# Altium schematic sheet CW308T_to_cardedge.SchDoc: <Enter Sheet Title>
size Letter; Organization: NewAE Technology Inc.; Address1: 1083 Queen St., Suite 196; Address2: Halifax; Address3: NS; Address4: Canada B3H 0B2; SheetApproved: NO
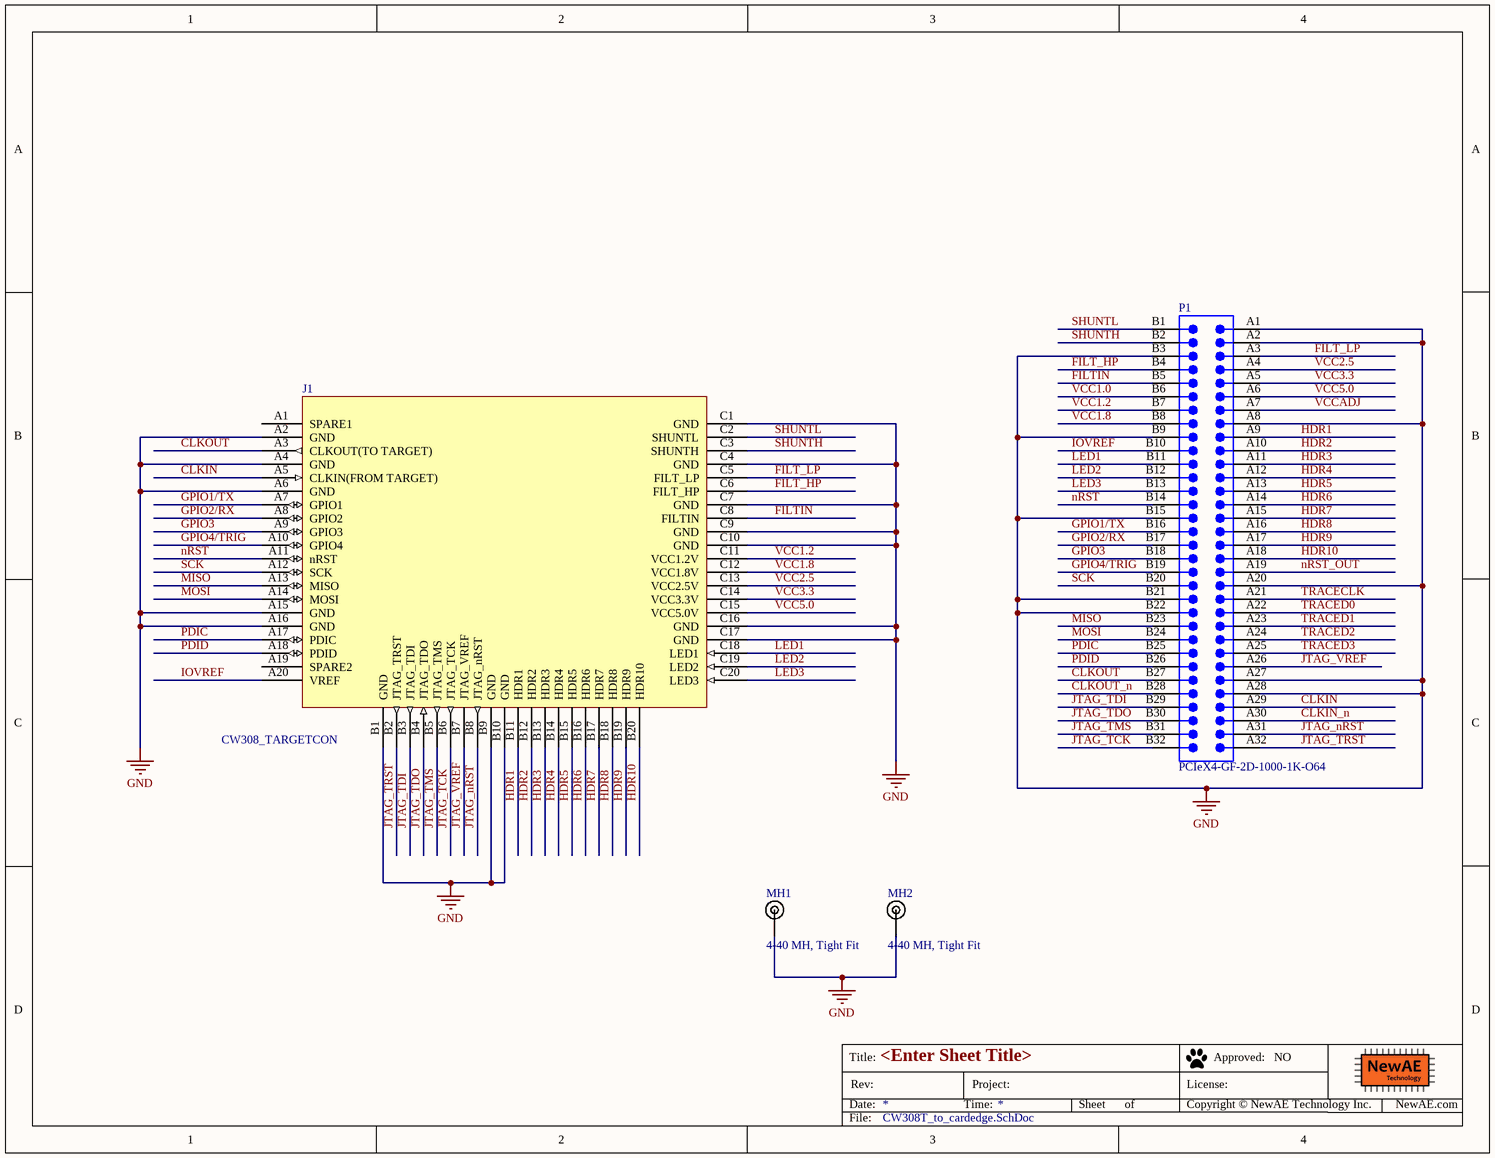
[diagram p0: CW308T_to_cardedge.SchDoc]

## Parts
J1  CW308_TARGETCON  [CW308_TBOARD_CONN]
MH1  4-40 MH, Tight Fit  [MOUNT_#4_TIGHT]
MH2  4-40 MH, Tight Fit  [MOUNT_#4_TIGHT]
P1  PCIeX4-GF-2D-1000-1K-O64  [PCIeX4-GF-2D-1000-1K-O64]  (no BOM)

## Nets
GND: J1.A2(GND) J1.A4(GND) J1.A6(GND) J1.A15(GND) J1.A16(GND) J1.B1(GND) J1.B9(GND) J1.B10(GND) J1.C1(GND) J1.C4(GND) J1.C7(GND) J1.C9(GND) J1.C10(GND) J1.C16(GND) J1.C17(GND) MH1.1 MH2.1 P1.A1 P1.A2 P1.A8 P1.A20 P1.A27 P1.A28 P1.B3 P1.B9 P1.B15 P1.B21 P1.B22
CLKIN: J1.A5(CLKIN(FROM_TARGET)) P1.A29
CLKIN_n: P1.A30
CLKOUT: J1.A3(CLKOUT(TO_TARGET)) P1.B27
CLKOUT_n: P1.B28
FILT_HP: J1.C6(FILT_HP) P1.B4
FILT_LP: J1.C5(FILT_LP) P1.A3
FILTIN: J1.C8(FILTIN) P1.B5
GPIO1/TX: J1.A7(GPIO1) P1.B16
GPIO2/RX: J1.A8(GPIO2) P1.B17
GPIO3: J1.A9(GPIO3) P1.B18
GPIO4/TRIG: J1.A10(GPIO4) P1.B19
HDR1: J1.B11(HDR1) P1.A9
HDR2: J1.B12(HDR2) P1.A10
HDR3: J1.B13(HDR3) P1.A11
HDR4: J1.B14(HDR4) P1.A12
HDR5: J1.B15(HDR5) P1.A13
HDR6: J1.B16(HDR6) P1.A14
HDR7: J1.B17(HDR7) P1.A15
HDR8: J1.B18(HDR8) P1.A16
HDR9: J1.B19(HDR9) P1.A17
HDR10: J1.B20(HDR10) P1.A18
IOVREF: J1.A20(VREF) P1.B10
JTAG_nRST: J1.B8(JTAG_nRST) P1.A31
JTAG_TCK: J1.B6(JTAG_TCK) P1.B32
JTAG_TDI: J1.B3(JTAG_TDI) P1.B29
JTAG_TDO: J1.B4(JTAG_TDO) P1.B30
JTAG_TMS: J1.B5(JTAG_TMS) P1.B31
JTAG_TRST: J1.B2(JTAG_TRST) P1.A32
JTAG_VREF: J1.B7(JTAG_VREF) P1.A26
LED1: J1.C18(LED1) P1.B11
LED2: J1.C19(LED2) P1.B12
LED3: J1.C20(LED3) P1.B13
MISO: J1.A13(MISO) P1.B23
MOSI: J1.A14(MOSI) P1.B24
nRST: J1.A11(nRST) P1.B14
nRST_OUT: P1.A19
PDIC: J1.A17(PDIC) P1.B25
PDID: J1.A18(PDID) P1.B26
SCK: J1.A12(SCK) P1.B20
SHUNTH: J1.C3(SHUNTH) P1.B2
SHUNTL: J1.C2(SHUNTL) P1.B1
TRACECLK: P1.A21
TRACED0: P1.A22
TRACED1: P1.A23
TRACED2: P1.A24
TRACED3: P1.A25
VCC1.0: P1.B6
VCC1.2: J1.C11(VCC1.2V) P1.B7
VCC1.8: J1.C12(VCC1.8V) P1.B8
VCC2.5: J1.C13(VCC2.5V) P1.A4
VCC3.3: J1.C14(VCC3.3V) P1.A5
VCC5.0: J1.C15(VCC5.0V) P1.A6
VCCADJ: P1.A7

Not connected (* = marked no-connect by the designer): J1 A1(SPARE1) A19(SPARE2)

## Notes on the sheet
- Title:
- Date:
- Rev:
- Time:
- Project:
- Sheet
- of
- License:
- Copyright © NewAE Technology Inc.
- Approved:
- NewAE.com
- File:

## Library data of the parts
J1 = CW308_TBOARD: CW308 "Standard" Target Board Connector; Component Group: Mechanical; Pitch: 2.54mm; Part Number: CW308_TBOARD; Pin Count: 60; Mounting Technology: Through-hole; Component Kind: Standard; Component Type: Standard
MH1 MH2 = MOUNT_#4_TIGHT: Machine screw 4-40 Mounting Hole; Component Group: Mechanical; PP Material Stack: 0; Part Number: MOUNT_#4_TIGHT; Pin Count: 1; Component Kind: Mechanical; Component Type: Mechanical; PP Rotation: 0
P1 = CMP-0001-00031-2: Golden finger, PCIeX4, Dual, Opposite, Pitch 1mm, 64-Position; Mating Connector: Molex-87715-9106; Publisher: Altium; ClassName: Edge Connector; Datasheet Version: rev2.0, Apr-2007; Package Reference: PCIeX4-GF-2D-1000-1K-O64